# Altium schematic sheet 9 h bridge.SchDoc
size A4; DocumentNumber: 9; SheetNumber: 11; SheetTotal: 12
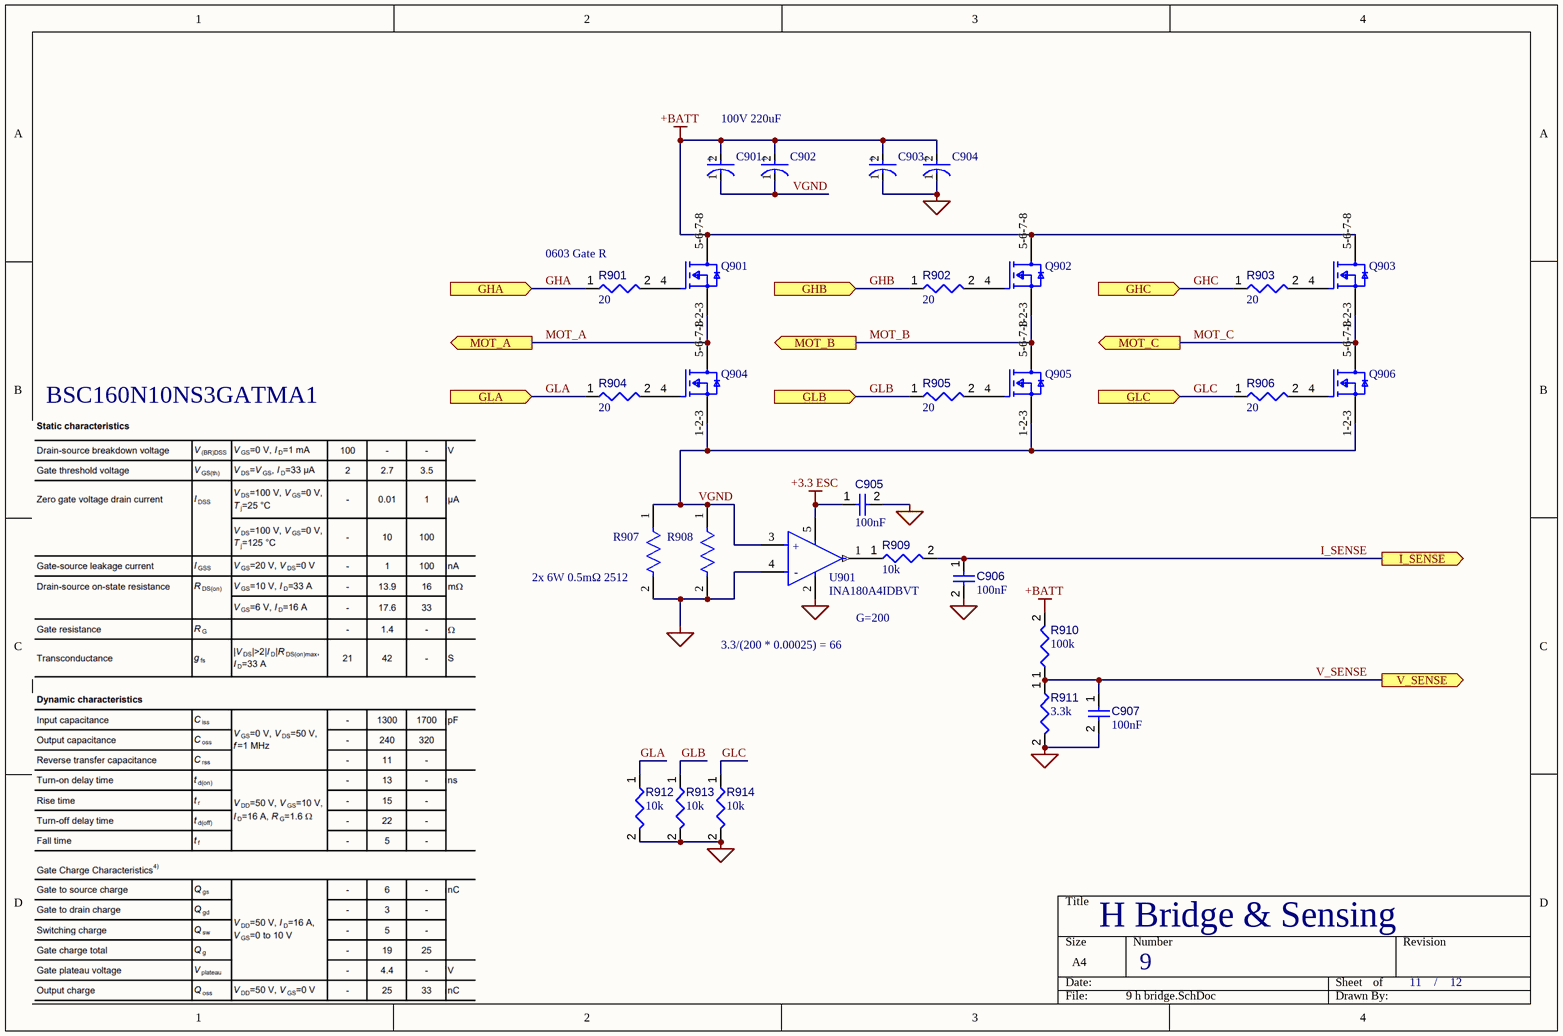
[diagram p0: 9 h bridge.SchDoc]

## Parts
C901  EMVY101ARA101MKE0S  [FP-MVYAKE0-MFG]  (value not drawn)
C902  EMVY101ARA101MKE0S  [FP-MVYAKE0-MFG]  (value not drawn)
C903  EMVY101ARA101MKE0S  [FP-MVYAKE0-MFG]  (value not drawn)
C904  EMVY101ARA101MKE0S  [FP-MVYAKE0-MFG]  (value not drawn)
C905  value 100nF  [CAPC0402(1005)60_L]  (hidden comment: Capacitor 100nF +/-20% 25V 0402)
C906  value 100nF  [CAPC0402(1005)60_L]  (hidden comment: Capacitor 100nF +/-20% 25V 0402)
C907  value 100nF  [CAPC0402(1005)60_L]  (hidden comment: Capacitor 100nF +/-20% 25V 0402)
Q901  IAUC120N06S5N017ATMA1  [FP-PG-TDSON-8-MFG]  (value not drawn)
Q902  IAUC120N06S5N017ATMA1  [FP-PG-TDSON-8-MFG]  (value not drawn)
Q903  IAUC120N06S5N017ATMA1  [FP-PG-TDSON-8-MFG]  (value not drawn)
Q904  IAUC120N06S5N017ATMA1  [FP-PG-TDSON-8-MFG]  (value not drawn)
Q905  IAUC120N06S5N017ATMA1  [FP-PG-TDSON-8-MFG]  (value not drawn)
Q906  IAUC120N06S5N017ATMA1  [FP-PG-TDSON-8-MFG]  (value not drawn)
R901  value 20  [RESC0603(1608)_L]  (hidden comment: Resistor 20R +/-5 % 0603 0.1 W)
R902  value 20  [RESC0603(1608)_L]  (hidden comment: Resistor 20R +/-5 % 0603 0.1 W)
R903  value 20  [RESC0603(1608)_L]  (hidden comment: Resistor 20R +/-5 % 0603 0.1 W)
R904  value 20  [RESC0603(1608)_L]  (hidden comment: Resistor 20R +/-5 % 0603 0.1 W)
R905  value 20  [RESC0603(1608)_L]  (hidden comment: Resistor 20R +/-5 % 0603 0.1 W)
R906  value 20  [RESC0603(1608)_L]  (hidden comment: Resistor 20R +/-5 % 0603 0.1 W)
R907  PSL2NTEBL500F  [FP-PSL2NTEBL500F-MFG]  (value not drawn)
R908  PSL2NTEBL500F  [FP-PSL2NTEBL500F-MFG]  (value not drawn)
R909  value 10k  [RESC0402(1005)_L]  (hidden comment: Resistor 10K  +/-1 % 0402 63 mW)
R910  value 100k  [RESC0402(1005)_L]  (hidden comment: Resistor 100K +/-1 % 0402 63 mW)
R911  value 3.3k  [RESC0402(1005)_L]  (hidden comment: Resistor 3K3 +/-1 % 0402 63 mW)
R912  value 10k  [RESC0402(1005)_L]  (hidden comment: Resistor 10K  +/-1 % 0402 63 mW)
R913  value 10k  [RESC0402(1005)_L]  (hidden comment: Resistor 10K  +/-1 % 0402 63 mW)
R914  value 10k  [RESC0402(1005)_L]  (hidden comment: Resistor 10K  +/-1 % 0402 63 mW)
U901  INA180A4IDBVT  [FP-DBV0005A-MFG]

## Ports
GHA (in), GHB (in), GHC (in), GLA (in), GLB (in), GLC (in), I_SENSE (out), MOT_A (out), MOT_B (out), MOT_C (out), V_SENSE (out)

## Nets
+3.3 ESC: C905.1 U901.5(VS)
+BATT: C901.2(A) C902.2(A) C903.2(A) C904.2(A) Q901.5-6-7-8(D) Q902.5-6-7-8(D) Q903.5-6-7-8(D) R910.2
PGND: C903.1(C) C904.1(C) C905.2 C906.2 C907.2 R907.2 R908.2 R911.2 R912.2 R913.2 R914.2 U901.2(GND) U901.4(IN-)
GHA: R901.1 ; port GHA
GHB: R902.1 ; port GHB
GHC: R903.1 ; port GHC
GLA: R904.1 R912.1 ; port GLA
GLB: R905.1 R913.1 ; port GLB
GLC: R906.1 R914.1 ; port GLC
I_SENSE: C906.1 R909.2 ; port I_SENSE
MOT_A: Q901.1-2-3(S) Q904.5-6-7-8(D) ; port MOT_A
MOT_B: Q902.1-2-3(S) Q905.5-6-7-8(D) ; port MOT_B
MOT_C: Q903.1-2-3(S) Q906.5-6-7-8(D) ; port MOT_C
V_SENSE: C907.1 R910.1 R911.1 ; port V_SENSE
VGND: C901.1(C) C902.1(C) Q904.1-2-3(S) Q905.1-2-3(S) Q906.1-2-3(S) R907.1 R908.1 U901.3(IN+)
NetQ901_4: Q901.4(G) R901.2
NetQ902_4: Q902.4(G) R902.2
NetQ903_4: Q903.4(G) R903.2
NetQ904_4: Q904.4(G) R904.2
NetQ905_4: Q905.4(G) R905.2
NetQ906_4: Q906.4(G) R906.2
NetR909_1: R909.1 U901.1(OUT)

## Notes on the sheet
- 100V 220uF
- (near R901) 0603 Gate R
- BSC160N10NS3GATMA1
- (near R907) 2x 6W 0.5mΩ 2512
- 3.3/(200 * 0.00025) = 66
- G=200
- H Bridge & Sensing
- /
- (in symbol CMP-04895-000007-1) +; -
- (in symbol CMP-33768-000015-1) +

## Library data of the parts
C901-C904 = CMP-33768-000015-1: CAP ALUM 100UF 20% 100V SMD; Life (Hours): 5000Hour; Ripple Current: 450mA; ESR (Equivalent Series Resistance): 330mR; Dielectric Material: Aluminium; Voltage Rating: 100V; Min Operating Temperature: -40°C; Voltage Rating (DC): 100V; Construction: Cylindrical; Height - Seated (Max): 0.531inch; Tolerance: 20%; Termination: SMD/SMT; Diameter: 12.5mm; Mount: Surface Mount; Series: MVY; Height: 13.5mm; Lead Free: Lead Free; Width: 13mm; Case/Package: Radial; Ripple Current (AC): 450mA; Capacitance: 100uF; Packaging: Tape and Reel; Impedance: 330mR; Length: 0.53inch; Package Quantity: 200; RoHS Compliant: Yes; Max Operating Temperature: 105°C
C905-C907 = CMP-001-00065-4: Chip Capacitor, 100nF +/-20%, 25V, 0402, Thickness 0.6 mm; Tolerance: 10%; Max Operating Temperature: 85°C; Min Operating Temperature: -55°C; Pins: 2; Voltage Rating: 25V; Mounting Technology: SMT; Case/Package: 0402
Q901-Q906 = CMP-32901-000676-1: MOSFET N-CH 60V 120A TDSON-8-43
R901-R906 = CMP-009-00183-1: Chip Resistor, 20 Ohms, +/-5 %, 0.1 W, -55 to 155 degC, 0603; Tolerance: 5%; Power: 100mW; Pins: 2; Max Operating Temperature: 155°C; Case/Package: 0603; Min Operating Temperature: -55°C
R907 R908 = CMP-04015-070281-1: RES 500 UOHM 1% 8W NONSTANDARD; RoHS Compliant: Yes
R909 R912-R914 = CMP-009-00149-3: Chip Resistor, 10 kOhms, +/-1 %, 63 mW, -55 to 125 degC, 0402; Power: 63mW; Tolerance: 1%; Min Operating Temperature: -55°C; Case/Package: 0402; Max Operating Temperature: 155°C; Pins: 2
R910 = CMP-009-00168-3: Chip Resistor, 100 kOhms, +/-1 %, 63 mW, -55 to 155 degC, 0402; Tolerance: 1%; Power: 63mW; Max Operating Temperature: 155°C; Min Operating Temperature: -55°C; Pins: 2; Case/Package: 0402
R911 = CMP-009-00145-3: Chip Resistor, 3.3 kOhms, +/-1 %, 63 mW, -55 to 155 degC, 0402; Tolerance: 1%; Power: 63mW; Case/Package: 0402; Min Operating Temperature: -55°C; Max Operating Temperature: 155°C; Pins: 2
U901 = CMP-04895-000007-1: IC CURR SENSE 1 CIRCUIT SOT23-5; Manufacturer: Texas Instruments; Output Current Per Channel: 8mA; Max Supply Voltage: 5.5V; Input Bias Current: 80uA; Bandwidth: 105kHz; Min Supply Voltage: 2.7V; Input Offset Voltage: 0.1mV; Number Of Channels: 1; Max Junction Temp: +150°C; Standoff Height: 0mm; Nominal Supply Current: 197uA; Voltage Gain: 0.2V/mV; Temperature: -40°C to +125°C; RoHS: TRUE; Ambient Temperature Range High: +125°C; Device Class L3: Instrumentation; Temperature Range High: +125°C; Height: 1.45mm; Octopart: https://octopart.com/ina180a4idbvt-texas+instruments-81856280; ComponentLink2Description: Datasheet; Digikey Description: IC CURR SENSE 1 CIRCUIT SOT23-5; Category: IC; ComponentLink2URL: http://www.ti.com/lit/ds/symlink/ina180.pdf; Ambient Temperature Range Low: -40°C; Temperature Range Low: -40°C; Automotive: No; Package: DBV0005A; Device Class L1: Integrated Circuits (ICs); Ipc Land Pattern Name: SOT95P280X145-5; Manufacturer Part Number: INA180A4IDBVT; Device Class L2: Linear ICs; Lead Free: Yes